# Altium schematic sheet lvds_drv_e.SchDoc: HDMI  LVDS
size B; Author: JO; DrawnBy: JO; Engineer: JO; DocumentNumber: 091117; Revision: B; SheetNumber: 2; SheetTotal: 2; PageSetup: Record=PageOptions|CenterHorizontal=True|CenterVertical=True|PrintScale=0.95|XCorrection=1.00|YCorrection=1.00|PrintKind=1|BorderSize=5000000|LeftOffset=0|BottomOffset=0|Orientation=2|PaperLength=1000|PaperWidth=1000|Scale=100|PaperSource=7|PrintQuality=-4|MediaType=1|DitherType=10|PaperKind=Letter|PrintScaleMode=1; DocumentName: LVDS Drv
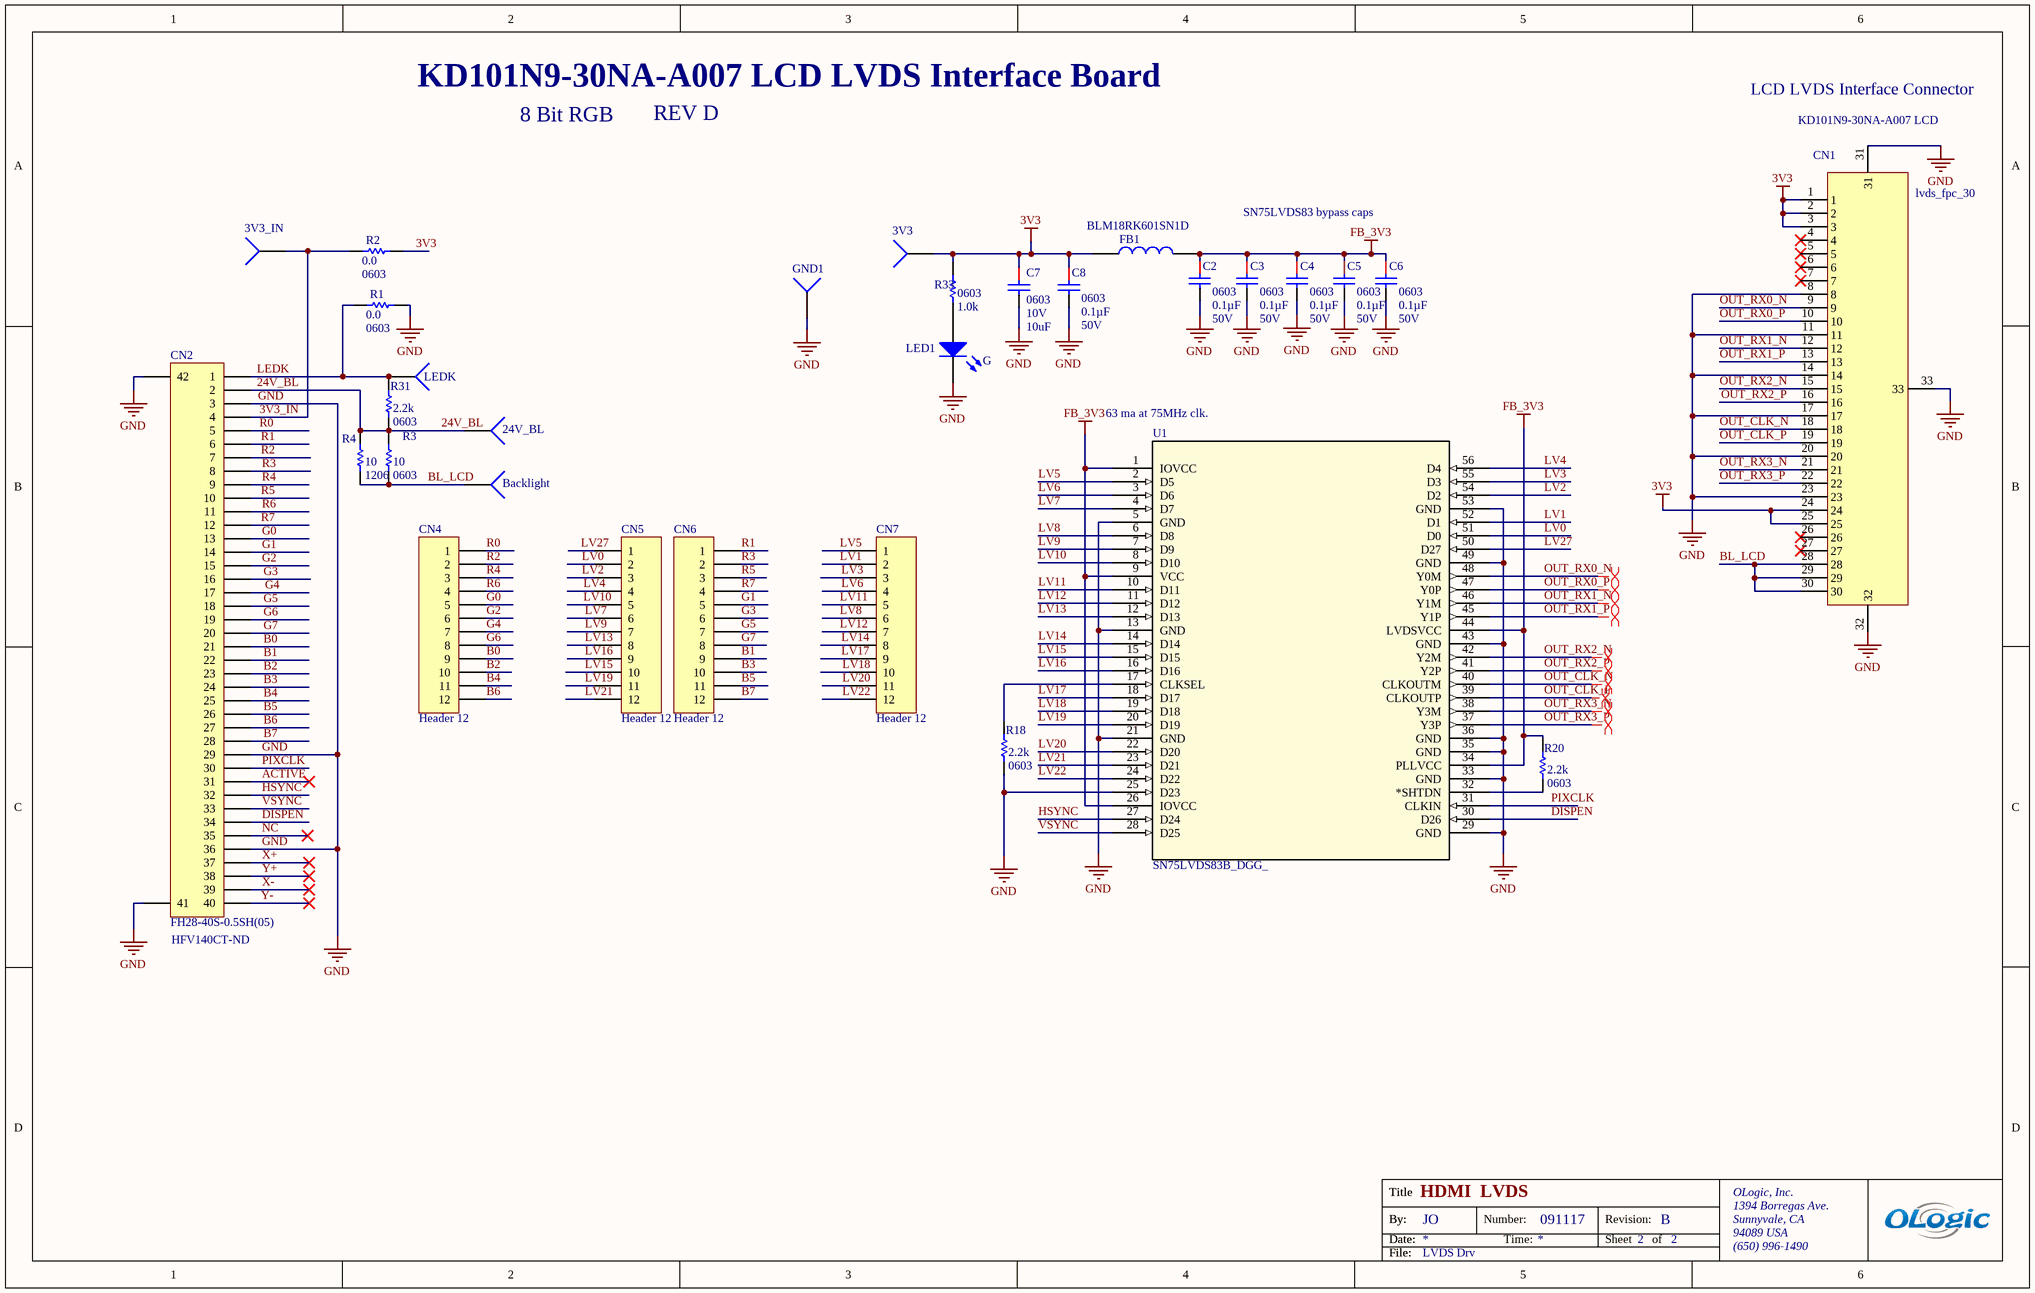
[diagram p0: lvds_drv_e.SchDoc]

## Parts
3V3  (no value)  [TestPoint-TH 35 mil]  (no BOM)
3V3_IN  (no value)  [TestPoint-TH 35 mil]  (no BOM)
24V_BL  (no value)  [TestPoint-TH 35 mil]  (no BOM)
Backlight  (no value)  [TestPoint-TH 35 mil]  (no BOM)
C2  Package / Case: 0603  Capacitance: 0.1µF  Voltage - Rated: 50V  [CAPC0603(1608)_N]  (hidden comment: 0.1uF 0603 50V)
C3  Package / Case: 0603  Capacitance: 0.1µF  Voltage - Rated: 50V  [CAPC0603(1608)_N]  (hidden comment: 0.1uF 0603 50V)
C4  Package / Case: 0603  Capacitance: 0.1µF  Voltage - Rated: 50V  [CAPC0603(1608)_N]  (hidden comment: 0.1uF 0603 50V)
C5  Package / Case: 0603  Capacitance: 0.1µF  Voltage - Rated: 50V  [CAPC0603(1608)_N]  (hidden comment: 0.1uF 0603 50V)
C6  Package / Case: 0603  Capacitance: 0.1µF  Voltage - Rated: 50V  [CAPC0603(1608)_N]  (hidden comment: 0.1uF 0603 50V)
C7  Package / Case: 0603  Voltage - Rated: 10V  Capacitance: 10uF  [CAPC0603(1608)_N]  (hidden comment: CAP 10UF 10V 10% X5R 0603)
C8  Package / Case: 0603  Capacitance: 0.1µF  Voltage - Rated: 50V  [CAPC0603(1608)_N]  (hidden comment: 0.1uF 0603 50V)
CN1  lvds_fpc_30  [LVDS_FPC_30]
CN2  FH28-40S-0.5SH(05)  [FH28-40S-0.5SH(05)]
CN4  Header 12  [HDR1X12]
CN5  Header 12  [HDR1X12]
CN6  Header 12  [HDR1X12]
CN7  Header 12  [HDR1X12]
FB1  BLM18RK601SN1D  [RESC0603(1608)_N]
GND1  (no value)  [TestPoint-TH 35 mil]  (no BOM)
LED1  G  [SM-LED-0603]
LEDK  (no value)  [TestPoint-TH 35 mil]  (no BOM)
R1  Resistance (Ohms): 0.0  Package / Case: 0603  [RESC0603(1608)_N]  (hidden comment: 0)
R2  Resistance (Ohms): 0.0  Package / Case: 0603  [RESC0603(1608)_N]  (hidden comment: 0)
R3  Package / Case: 0603  [RESC0805(2012)_N]  (hidden comment: 10)
R4  Package / Case: 1206  [RESC1206(3216)_N]  (hidden comment: 10)
R18  Package / Case: 0603  [RESC0603(1608)_N]  (hidden comment: 2.2K)
R20  Package / Case: 0603  [RESC0603(1608)_N]  (hidden comment: 2.2K)
R31  Package / Case: 0603  [RESC0603(1608)_N]  (hidden comment: 2.2K)
R33  Package / Case: 0603  [RESC0603(1608)_N]  (hidden comment: 1.0K)
U1  SN75LVDS83B_DGG_  [DGG56]

## Nets
3V3: 3V3.1 C7.1 C8.1 CN1.1 CN1.2 CN1.3 CN1.24 CN1.25 FB1.1 R2.1 R33.1
FB_3V3: C2.1 C3.1 C4.1 C5.1 C6.1 FB1.2 R20.1 U1.1(IOVCC) U1.9(VCC) U1.26(IOVCC) U1.34(PLLVCC) U1.44(LVDSVCC)
GND: C2.2 C3.2 C4.2 C5.2 C6.2 C7.2 C8.2 CN1.8 CN1.11 CN1.14 CN1.17 CN1.20 CN1.23 CN1.31 CN1.32 CN1.33 CN2.3 CN2.29 CN2.36 CN2.41 CN2.42 GND1.1 LED1.2 R1.1 R18.2 U1.5(GND) U1.13(GND) U1.21(GND) U1.25(D23) U1.29(GND) U1.33(GND) U1.35(GND) U1.36(GND) U1.43(GND) U1.49(GND) U1.53(GND)
3V3_IN: 3V3_IN.1 CN2.4 R2.2
24V_BL: 24V_BL.1 CN2.2 R3.2 R4.2 R31.2
ACTIVE: CN2.31
B0: CN2.21 CN4.9
B1: CN2.22 CN6.9
B2: CN2.23 CN4.10
B3: CN2.24 CN6.10
B4: CN2.25 CN4.11
B5: CN2.26 CN6.11
B6: CN2.27 CN4.12
B7: CN2.28 CN6.12
BL_LCD: Backlight.1 CN1.28 CN1.29 CN1.30 R3.1 R4.1
DISPEN: CN2.34 U1.30(D26)
G0: CN2.13 CN4.5
G1: CN2.14 CN6.5
G2: CN2.15 CN4.6
G3: CN2.16 CN6.6
G4: CN2.17 CN4.7
G5: CN2.18 CN6.7
G6: CN2.19 CN4.8
G7: CN2.20 CN6.8
HSYNC: CN2.32 U1.27(D24)
LEDK: CN2.1 LEDK.1 R1.2 R31.1
LV0: CN5.2 U1.51(D0)
LV1: CN7.2 U1.52(D1)
LV2: CN5.3 U1.54(D2)
LV3: CN7.3 U1.55(D3)
LV4: CN5.4 U1.56(D4)
LV5: CN7.1 U1.2(D5)
LV6: CN7.4 U1.3(D6)
LV7: CN5.6 U1.4(D7)
LV8: CN7.6 U1.6(D8)
LV9: CN5.7 U1.7(D9)
LV10: CN5.5 U1.8(D10)
LV11: CN7.5 U1.10(D11)
LV12: CN7.7 U1.11(D12)
LV13: CN5.8 U1.12(D13)
LV14: CN7.8 U1.14(D14)
LV15: CN5.10 U1.15(D15)
LV16: CN5.9 U1.16(D16)
LV17: CN7.9 U1.18(D17)
LV18: CN7.10 U1.19(D18)
LV19: CN5.11 U1.20(D19)
LV20: CN7.11 U1.22(D20)
LV21: CN5.12 U1.23(D21)
LV22: CN7.12 U1.24(D22)
LV27: CN5.1 U1.50(D27)
NC: CN2.35
OUT_CLK_N: CN1.18 U1.40(CLKOUTM)
OUT_CLK_P: CN1.19 U1.39(CLKOUTP)
OUT_RX0_N: CN1.9 U1.48(Y0M)
OUT_RX0_P: CN1.10 U1.47(Y0P)
OUT_RX1_N: CN1.12 U1.46(Y1M)
OUT_RX1_P: CN1.13 U1.45(Y1P)
OUT_RX2_N: CN1.15 U1.42(Y2M)
OUT_RX2_P: CN1.16 U1.41(Y2P)
OUT_RX3_N: CN1.21 U1.38(Y3M)
OUT_RX3_P: CN1.22 U1.37(Y3P)
PIXCLK: CN2.30 U1.31(CLKIN)
R0: CN2.5 CN4.1
R1: CN2.6 CN6.1
R2: CN2.7 CN4.2
R3: CN2.8 CN6.2
R4: CN2.9 CN4.3
R5: CN2.10 CN6.3
R6: CN2.11 CN4.4
R7: CN2.12 CN6.4
VSYNC: CN2.33 U1.28(D25)
X+: CN2.37
X-: CN2.39
Y+: CN2.38
Y-: CN2.40
NetLED1_1: LED1.1 R33.2
NetR18_1: R18.1 U1.17(CLKSEL)
NetR20_2: R20.2 U1.32(*SHTDN)

Not connected (* = marked no-connect by the designer): CN1 4* 5* 6* 7* 26* 27*

## Layout directives
differential pair: OUT_CLK_N, OUT_CLK_P, OUT_RX0_N, OUT_RX0_P, OUT_RX1_N, OUT_RX1_P, OUT_RX2_N, OUT_RX2_P, OUT_RX3_N, OUT_RX3_P

## Notes on the sheet
- KD101N9-30NA-A007 LCD LVDS Interface Board
- LCD LVDS Interface Connector
- 8 Bit RGB
- REV D
- (near CN1) KD101N9-30NA-A007 LCD
- SN75LVDS83 bypass caps
- (near U1) 63 ma at 75MHz clk.
- (near CN2) HFV140CT-ND
- Title
- By:
- Date:
- Number:
- Time:
- Revision:
- Sheet
- of
- OLogic, Inc.
- 1394 Borregas Ave.
- Sunnyvale, CA
- 94089 USA
- File:
- (650) 996-1490

## Library data of the parts
3V3 3V3_IN 24V_BL Backlight GND1 LEDK = TestPoint: Test Point
C2-C6 C8 = CAP CER 0.1UF 50V 10% X7R 0603: Manufacturer: Yageo; Manufacturer Part Number: CC0603ZRY5V9BB104; Tolerance: -20%, +80%; Temperature Coefficient: Y5V (F); ClassName: *; Supplier 1: Digi-Key; RoHS: RoHS Compliant; Category: Capacitors; Stock 1: 2192156; Pricing 1: 1=0.1, 10=0.019, 100=0.0087, 500=0.0062, 1000=0.00487 (USD); Packaging: Cut Tape (CT); Part Status: Active; Operating Temperature: -30°C ~ 85°C; Features: -; Ratings: -; Applications: General Purpose; Failure Rate: -; Mounting Type: Surface Mount, MLCC; Size / Dimension: 0.063" L x 0.031" W (1.60mm x 0.80mm); Height - Seated (Max): -; Thickness (Max): 0.035" (0.90mm); Lead Spacing: -; Lead Style: -; ComponentLink1URL: http://www.yageo.com/documents/recent/UPY-GPHC_Y5V_6.3V-to-50V_8.pdf; ComponentLink1Description: http://www.yageo.com/documents/recent/UPY-GPHC_Y5V_6.3V-to-50V_8.pdf; Supplier Part Number 1: 311-1343-1-ND
C7 = CAP CER 10UF 10V 10% X5R 0603: 10uF 0603; Manufacturer: Samsung Electro-Mechanics America, Inc; Manufacturer Part Number: CL10A106KP8NNNC; ClassName: *; Supplier 1: Digi-Key; RoHS: RoHS Compliant; Category: Capacitors; Stock 1: 157585; Pricing 1: 1=0.48, 10=0.42, 25=0.3, 100=0.21, 500=0.153, 1000=0.138 (USD); Packaging: Cut Tape (CT); Tolerance: ±10%; Temperature Coefficient: X5R; Mounting Type: Surface Mount, MLCC; Operating Temperature: -55°C ~ 85°C; Applications: General Purpose; Ratings: -; Size / Dimension: 0.063" L x 0.031" W (1.60mm x 0.80mm); Height - Seated (Max): -; Thickness (Max): 0.035" (0.90mm); Lead Spacing: -; Features: -; Lead Style: -; ComponentLink1URL: http://www.samsungsem.com/kr/front/downloadcms.do?path=/kr/support/product-search/mlcc/__icsFiles/afieldfile/2014/11/05&fileName=S_CL10A106KP8NNNC.pdf; ComponentLink1Description: http://www.samsungsem.com/kr/front/downloadcms.do?path=/kr/support/product-search/mlcc/__icsFiles/afieldfile/2014/11/05&fileName=S_CL10A106KP8NNNC.pdf; Supplier Part Number 1: 1276-1192-1-ND
CN2 = FH28-40S-0.5SH(05): Flex Cable, 40P, 0.5mm Pitch; Manufacturer: Hirose Electric Co Ltd; Flat Flex Type: FFC, FPC; Connector/Contact Type: Contacts, Bottom; Number of Positions: 40; Pitch: 0.020" (0.50mm); FFC, FCB Thickness: 0.30mm; Locking Feature: Rotary Lock; Cable End Type: Tabbed; Actuator Material: Liquid Crystal Polymer (LCP), Halogen Free; Voltage Rating: 50V; Material Flammability Rating: UL94 V-0; Current Rating: 0.5A; Actuator Color: Black; Mating Cycles: 20; Supplier 1: Digi-Key; Manufacturer Part Number: FH28-40S-0.5SH(05); RoHS: RoHS Compliant; Category: Connectors, Interconnects; Stock 1: 10719; Pricing 1: 1=2.41, 10=2.183, 25=2.0492, 50=1.9602, 100=1.8711, 250=1.69292, 500=1.55926, 1000=1.3365 (USD); Packaging: Cut Tape (CT); Part Status: Active; Mounting Type: Surface Mount, Right Angle; Termination: Solder; Height Above Board: 0.100" (2.54mm); Contact Material: Phosphor Bronze; Contact Finish: Gold; Housing Material: Liquid Crystal Polymer (LCP), Halogen Free; Features: Solder Retention, Zero Insertion Force (ZIF); Operating Temperature: -40°C ~ 105°C; Contact Finish Thickness: -; Housing Color: Gray; ComponentLink1URL: https://www.hirose.com/product/en/download_file/key_name/FH28/category/Catalog/doc_file_id/31647/?file_category_id=4&item_id=26&is_series=1; ComponentLink1Description: https://www.hirose.com/product/en/download_file/key_name/FH28/category/Catalog/doc_file_id/31647/?file_category_id=4&item_id=26&is_series=1; Supplier Part Number 1: HFV140CT-ND
CN4-CN7 = Header 12: Header, 12-Pin; LatestRevisionDate: 17-Jul-2002; LatestRevisionNote: Re-released for DXP Platform.; Publisher: Altium Limited
FB1 = FERRITE BEAD 120 OHM 0603 1LN: FERRITE 120 OHM 0603 500mA; Manufacturer: TDK Corporation; Manufacturer Part Number: MMZ1608R121ATA00; Filter Type: Signal Line; Number of Lines: 1; Impedance @ Frequency: 120 Ohm @ 100MHz; DC Resistance (DCR) (Max): 180 mOhm; ClassName: *; Creator: *; Supplier 1: Digi-Key; RoHS: RoHS Compliant; Category: Filters; Stock 1: 21122; Pricing 1: 1=0.1, 10=0.073, 100=0.0436, 250=0.03168, 500=0.02904, 1000=0.02508 (USD); Packaging: Cut Tape (CT); Part Status: Active; Current Rating (Max): 500mA; Ratings: -; Operating Temperature: -55°C ~ 125°C; Package / Case: 0603 (1608 Metric); Mounting Type: Surface Mount; Height (Max): 0.037" (0.95mm); Size / Dimension: 0.063" L x 0.031" W (1.60mm x 0.80mm); ComponentLink1URL: https://product.tdk.com/info/en/catalog/datasheets/beads_commercial_signal_mmz1608_en.pdf; ComponentLink1Description: https://product.tdk.com/info/en/catalog/datasheets/beads_commercial_signal_mmz1608_en.pdf; Supplier Part Number 1: 445-2170-1-ND
LED1 = 0603 LED: 0603 SMD LED; PN: P11500CT-ND; Vendor: Digikey
R1 R2 = RES 0.0 OHM 1/10W JUMP 0603 SMD: 0 0603; Manufacturer: Panasonic Electronic Components; Manufacturer Part Number: ERJ-3GEY0R00V; Tolerance: Jumper; Power (Watts): 0.1W, 1/10W; Supplier 1: Digi-Key; RoHS: RoHS Compliant; Category: Resistors; Stock 1: 4812214; Pricing 1: 1=0.1, 50=0.0126, 100=0.0096, 250=0.00716, 500=0.00528, 1000=0.00352, 2500=0.00297 (USD); Packaging: Cut Tape (CT); Composition: Thick Film; Features: -; Temperature Coefficient: -; Supplier Device Package: 0603; Size / Dimension: 0.063" L x 0.031" W (1.60mm x 0.80mm); Height: 0.022" (0.55mm); Number of Terminations: 2; ComponentLink1URL: http://industrial.panasonic.com/www-cgi/jvcr13pz.cgi?E+PZ+3+AOA0001+ERJ3GEY0R00V+7+WW; ComponentLink1Description: http://industrial.panasonic.com/www-cgi/jvcr13pz.cgi?E+PZ+3+AOA0001+ERJ3GEY0R00V+7+WW; Supplier Part Number 1: P0.0GCT-ND
R3 = RES 10 OHM 1/10W 1% 0603 SMD: 10 0603; Manufacturer: Panasonic Electronic Components; Manufacturer Part Number: ERJ-3EKF10R0V; Tolerance: ±1%; Power (Watts): 0.1W, 1/10W; Temperature Coefficient: ±100ppm/°C; Supplier 1: Digi-Key; RoHS: RoHS Compliant; Category: Resistors; Stock 1: 533402; Pricing 1: 1=0.1, 50=0.015, 100=0.0114, 250=0.00844, 500=0.00624, 1000=0.00416, 2500=0.00351 (USD); Packaging: Cut Tape (CT); Composition: Thick Film; Features: -; Supplier Device Package: 0603; Size / Dimension: 0.063" L x 0.031" W (1.60mm x 0.80mm); Height: 0.022" (0.55mm); Number of Terminations: 2; ComponentLink1URL: http://industrial.panasonic.com/www-cgi/jvcr13pz.cgi?E+PZ+3+AOA0002+ERJ3EKF10R0V+7+WW; ComponentLink1Description: http://industrial.panasonic.com/www-cgi/jvcr13pz.cgi?E+PZ+3+AOA0002+ERJ3EKF10R0V+7+WW; Supplier Part Number 1: P10.0HCT-ND; Resistance (Ohms): 10
R4 = RES 10 OHM 1/4W 1% 1206 SMD: 10 1206; Manufacturer: Panasonic Electronic Components; Manufacturer Part Number: ERJ-8ENF10R0V; Tolerance: ±1%; Power (Watts): 0.25W, 1/4W; Temperature Coefficient: ±100ppm/°C; Category: Resistors; Supplier 1: Digi-Key; RoHS: RoHS Compliant; Stock 1: 602214; Pricing 1: 1=0.1, 50=0.0368, 100=0.028, 250=0.0208, 500=0.01536, 1000=0.01024 (USD); Packaging: Cut Tape (CT); Resistance (Ohms): 10; Composition: Thick Film; Features: -; Supplier Device Package: 1206; Size / Dimension: 0.126" L x 0.063" W (3.20mm x 1.60mm); Height: 0.028" (0.70mm); Number of Terminations: 2; ComponentLink1URL: http://industrial.panasonic.com/www-cgi/jvcr13pz.cgi?E+PZ+3+AOA0002+ERJ8ENF10R0V+7+WW; ComponentLink1Description: http://industrial.panasonic.com/www-cgi/jvcr13pz.cgi?E+PZ+3+AOA0002+ERJ8ENF10R0V+7+WW; Supplier Part Number 1: P10.0FCT-ND
R18 R20 R31 = RES 2.2K OHM 1/10W 5% 0603 SMD: 2.2K 0603; Manufacturer: Panasonic Electronic Components; Manufacturer Part Number: ERJ-3GEYJ222V; Tolerance: ±5%; Power (Watts): 0.1W, 1/10W; Temperature Coefficient: ±200ppm/°C; Supplier 1: Digi-Key; RoHS: RoHS Compliant; Category: Resistors; Stock 1: 685364; Pricing 1: 1=0.1, 50=0.0126, 100=0.0096, 250=0.00716, 500=0.00528, 1000=0.00352, 2500=0.00297 (USD); Packaging: Cut Tape (CT); Resistance (Ohms): 2.2k; Composition: Thick Film; Features: -; Supplier Device Package: 0603; Size / Dimension: 0.063" L x 0.031" W (1.60mm x 0.80mm); Height: 0.022" (0.55mm); Number of Terminations: 2; ComponentLink1URL: http://industrial.panasonic.com/www-cgi/jvcr13pz.cgi?E+PZ+3+AOA0001+ERJ3GEYJ222V+7+WW; ComponentLink1Description: http://industrial.panasonic.com/www-cgi/jvcr13pz.cgi?E+PZ+3+AOA0001+ERJ3GEYJ222V+7+WW; Supplier Part Number 1: P2.2KGCT-ND
R33 = RES 1K OHM 1% 1/10W 0603: 1.0K 0603; Manufacturer: Stackpole Electronics Inc.; Manufacturer Part Number: RMCF0603FT1K00; Tolerance: ±1%; Power (Watts): 0.1W, 1/10W; Temperature Coefficient: ±100ppm/°C; Supplier 1: Digi-Key; RoHS: RoHS Compliant; Category: Resistors; Stock 1: 411308; Pricing 1: 1=0.1, 10=0.02, 100=0.0081, 1000=0.00364, 2500=0.00316 (USD); Packaging: Cut Tape (CT); Part Status: Active; Composition: Thick Film; Features: Automotive AEC-Q200; Operating Temperature: -55°C ~ 155°C; Size / Dimension: 0.061" L x 0.031" W (1.55mm x 0.80mm); Height - Seated (Max): 0.022" (0.55mm); Failure Rate: -; ComponentLink1URL: https://www.seielect.com/Catalog/SEI-RMCF_RMCP.pdf; ComponentLink1Description: https://www.seielect.com/Catalog/SEI-RMCF_RMCP.pdf; Supplier Part Number 1: RMCF0603FT1K00CT-ND; Supplier Device Package: 0603; Resistance (Ohms): 1.0k
U1 = SN75LVDS83B_DGG_: Imported; Manufacturer: Texas Instruments; Manufacturer_Part_Number: sn75lvds83b_dgg_56; INDUSTRY_STD_PKG_TYPE: TSSOP; FAMILY_NAME: FLATLINK (LVDS FOR LCD); PIN_COUNT: 56; PACKAGE_DESIGNATOR: DGG; Datasheet_URL: http://www.ti.com/lit/gpn/SN75LVDS83B; GENERIC_PART_NUMBER: SN75LVDS83B; Vendor: Texas Instruments; Value: Value; Type: Type; RefDes: RefDes